# EAGLE schematic ESP32_Routeur_PV (EAGLE 9.6.2)
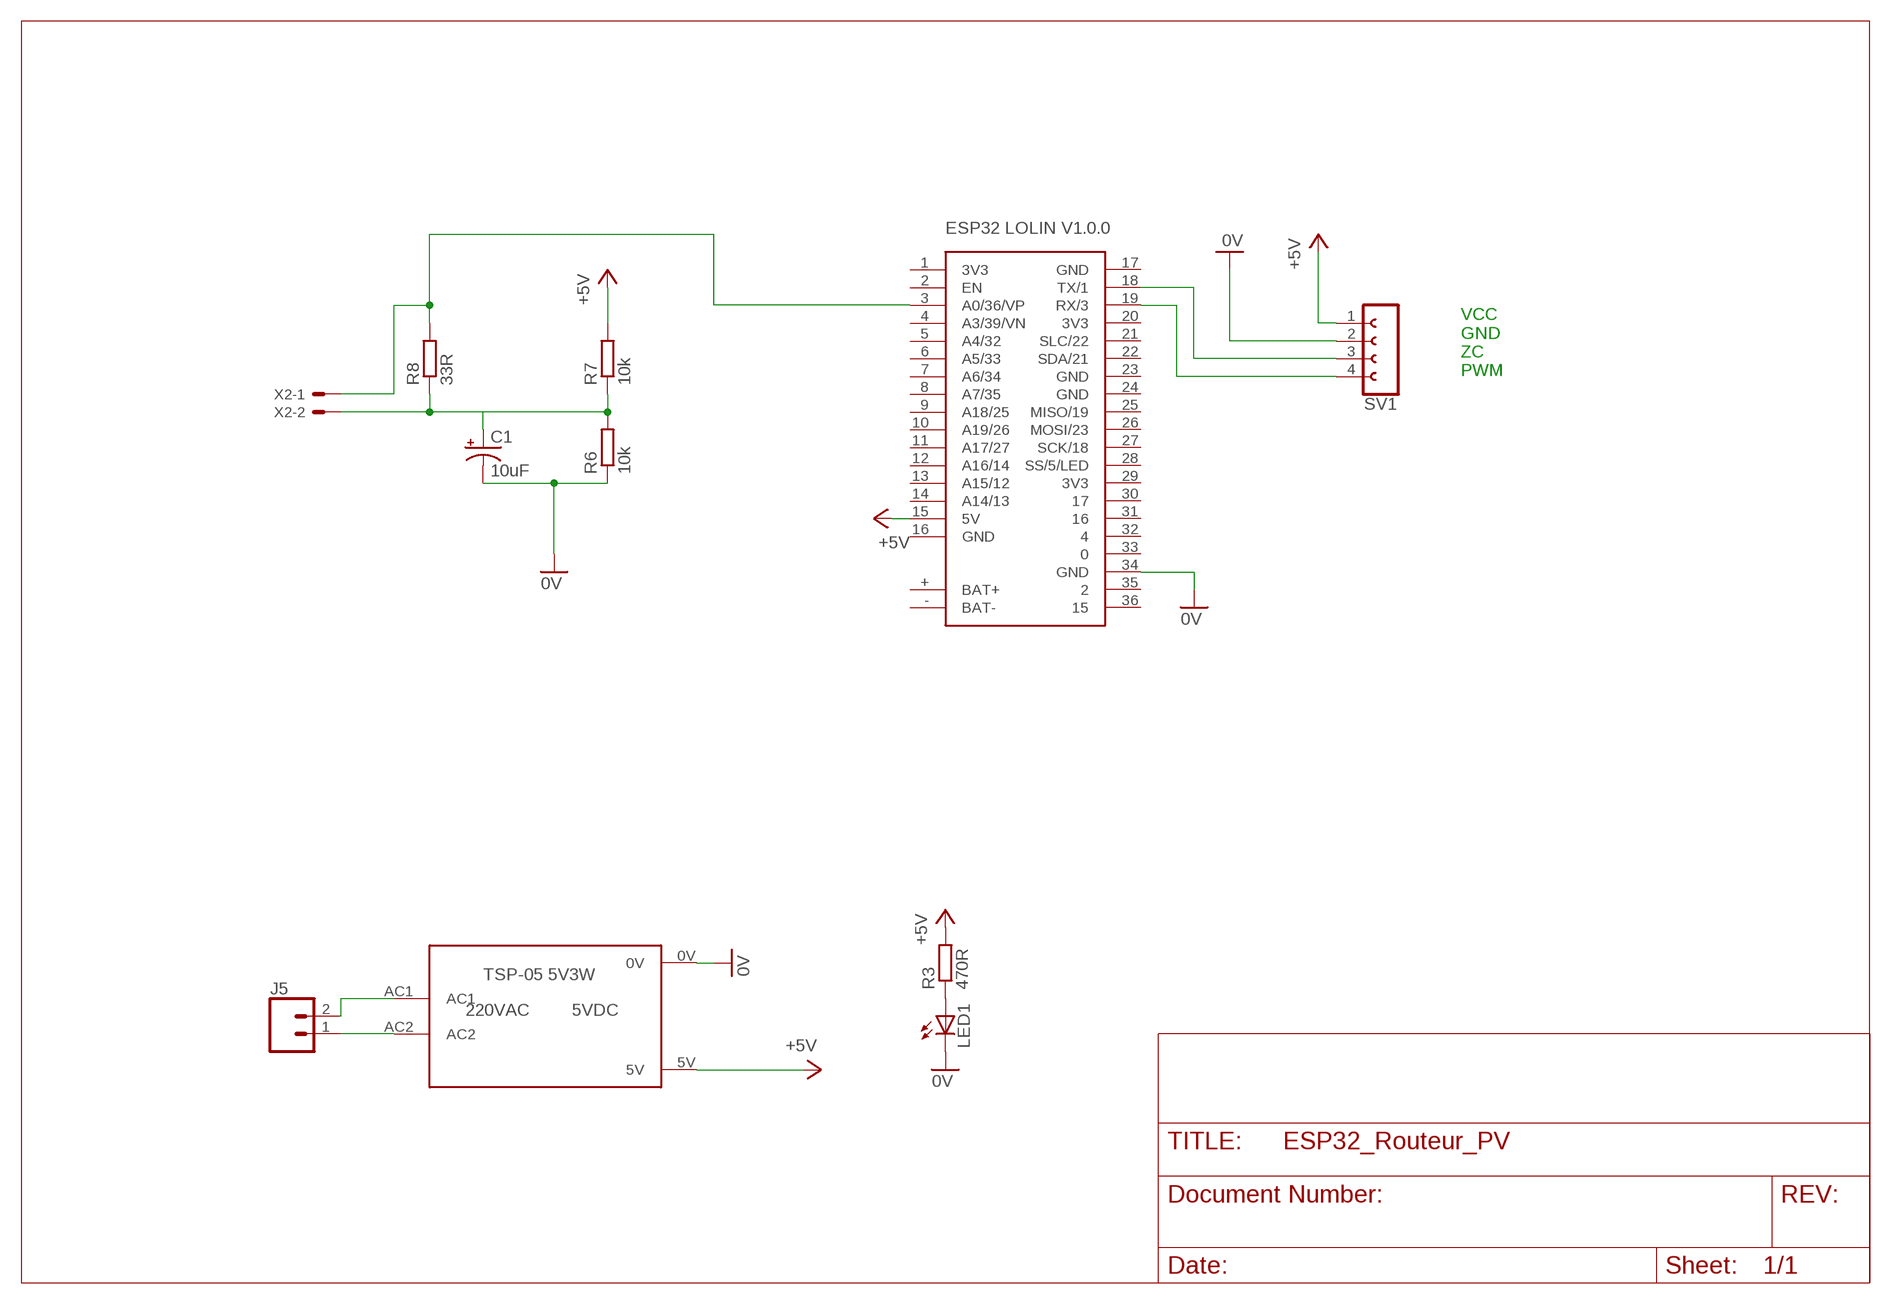
[diagram p0: schematic, sheet 1]

## Parts
C1  10uF  10UF-POLAR-RADIAL-2.5MM-25V-20%  [CPOL-RADIAL-2.5MM-5MM]
J5  CONN_025MM  [BORNIER_A_VIS_2_5.12MM]
LED1  LED5MM_F  [LED5MM]
R3  470R  R-EU_0207/10  [0207/10]
R6  10k  R-EU_0207/10  [0207/10]
R7  10k  R-EU_0207/10  [0207/10]
R8  33R  R-EU_0207/10  [0207/10]
SV1  FE04-1  [FE04-1]
U$3  TSP05-5V-3W  [TSP05-5V-3W]
U$4  ESP32_LOLIN_V1.0.0  [ESP32_LOLIN_V1.0.0]
X2  JST-XH-02-PIN-LONG-PAD  [JST-XH-02-PACKAGE-LONG-PAD]

## Nets
0V: C1.2(-) LED1.K(C) R6.1 SV1.2 U$3.0V U$4.34(GND)
+5V: R3.2 R7.2 SV1.1 U$3.5V U$4.15(5V)
N$1: LED1.A R3.1
N$2: C1.1(+) R6.2 R7.1 R8.1 X2.2
N$3: SV1.3 U$4.18(TX/1)
N$4: SV1.4 U$4.19(RX/3)
N$8: J5.2 U$3.AC1
N$11: J5.1 U$3.AC2
N$12: R8.2 U$4.3(A0/36/VP) X2.1
Unconnected: U$4.2(EN) U$4.4(A3/39/VN) U$4.5(A4/32) U$4.6(A5/33) U$4.7(A6/34) U$4.8(A7/35) U$4.9(A18/25) U$4.10(A19/26) U$4.11(A17/27) U$4.12(A16/14) U$4.13(A15/12) U$4.14(A14/13) U$4.21(SLC/22) U$4.22(SDA/21) U$4.25(MISO/19) U$4.26(MOSI/23) U$4.27(SCK/18) U$4.28(SS/5/LED) U$4.30 U$4.31 U$4.32 U$4.33 U$4.35 U$4.36

## Notes on the sheet
- VCC
  GND
  ZC
  PWM

## Power pins joined to a net without a drawn wire
3V3: U$4.1(3V3) U$4.20(3V3) U$4.29(3V3)
BAT+: U$4.+(BAT+)
BAT-: U$4.-(BAT-)
GND: U$4.16(GND) U$4.17(GND) U$4.23(GND) U$4.24(GND)

## Library data of the parts
C1 = SparkFun-Capacitors:10UF-POLAR: 10.0µF polarized capacitors A capacitor is a passive two-terminal electrical component used to store electrical energy temporarily in an electric field.; PROD_ID: CAP-08440
J5 = _Remy:CONN_02: Multi connection point. Often used as Generic Header-pin footprint for 0.1 inch spaced/style header connections On any of the 0.1 inch spaced packages, you can populate with these: Break Away Headers - Straight <https://www.sparkfun.com/products/116> (PRT-00116) Break Away Male Headers - Right Angle <https://www.sparkfun.com/products/553> (PRT-00553) Female Headers <https://www.sparkfun.com/products/115> (PRT-00115) Break Away Headers - Machine Pin <https://www.sparkfun.com/products/117> (PRT-00117) Break Away Female Headers - Swiss Machine Pin <https://www.sparkfun.com/products/743> (PRT-00743) For SCREWTERMINALS and SPRING TERMINALS visit here: Screw Terimnals on SparkFun.com <https://www.sparkfun.com/search/results?term=Screw+Terminals> (5mm/3.5mm/2.54mm spacing) This device is also useful as a general connection point to wire up your design to another part of your project. Our various solder wires solder well into these plated through hole pads. Hook-Up Wire - Assortment (Stranded, 22 AWG) <https://www.sparkfun.com/products/11375> (PRT-11375) Hook-Up Wire - Assortment (Solid Core, 22 AWG) <https://www.sparkfun.com/products/11367> (PRT-11367) View the entire wire category on our website here <https://www.sparkfun.com/categories/141> Special notes: Molex polarized connector foot print use with: PRT-08233 with associated crimp pins and housings. 2.54_SCREWTERM for use with PRT-10571. 3.5mm Screw Terminal footprints for PRT-08084 5mm Screw Terminal footprints for use with PRT-08432; SF_SKU: PRT-08432
LED1 = 00-LIVIO:LED: LEDS
R3 R6-R8 = 00-LIVIO:R-EU_: RESISTOR, European symbol
SV1 = 04_Remy:FE04-1: FEMALE HEADER
U$3 = _Remy:TSP05-5V-3W
U$4 = _Remy:ESP32_LOLIN_V1.0.0
X2 = con-JST XH Connectors v1-0:JST-XH-02-PIN: JST XH Connector 2 Pin Wire to board connector. Pitch: 2,54 mm, (0.100") Number of pins: 2 Created by Rembrandt Electronics www.rembrandtelectronics.com